# Altium schematic sheet revision_log.schdoc: Revision Log
size 431 x 279 mm; DrawnBy: D. Bruey, M. Ciuffo; Organization: Synapse Product Development, LLC.; Address1: 1511 6th Ave., Suite 400; Address2: Seattle, Washington 98101; Address3: 206.381.0898; Address4: www.synapse.com; DocumentNumber: 2; SheetNumber: 2; SheetTotal: 2; PageSetup: Record=PageOptions|CenterHorizontal=True|CenterVertical=True|PrintScale=1.06|XCorrection=1.00|YCorrection=1.00|PrintKind=1|BorderSize=5000000|LeftOffset=0|BottomOffset=0|Orientation=2|PaperLength=4318|PaperWidth=2794|Scale=100|PaperSource=7|PrintQuality=200|MediaType=1|DitherType=10|PrintScaleMode=1|PaperKind=11x17|PaperIndex=3
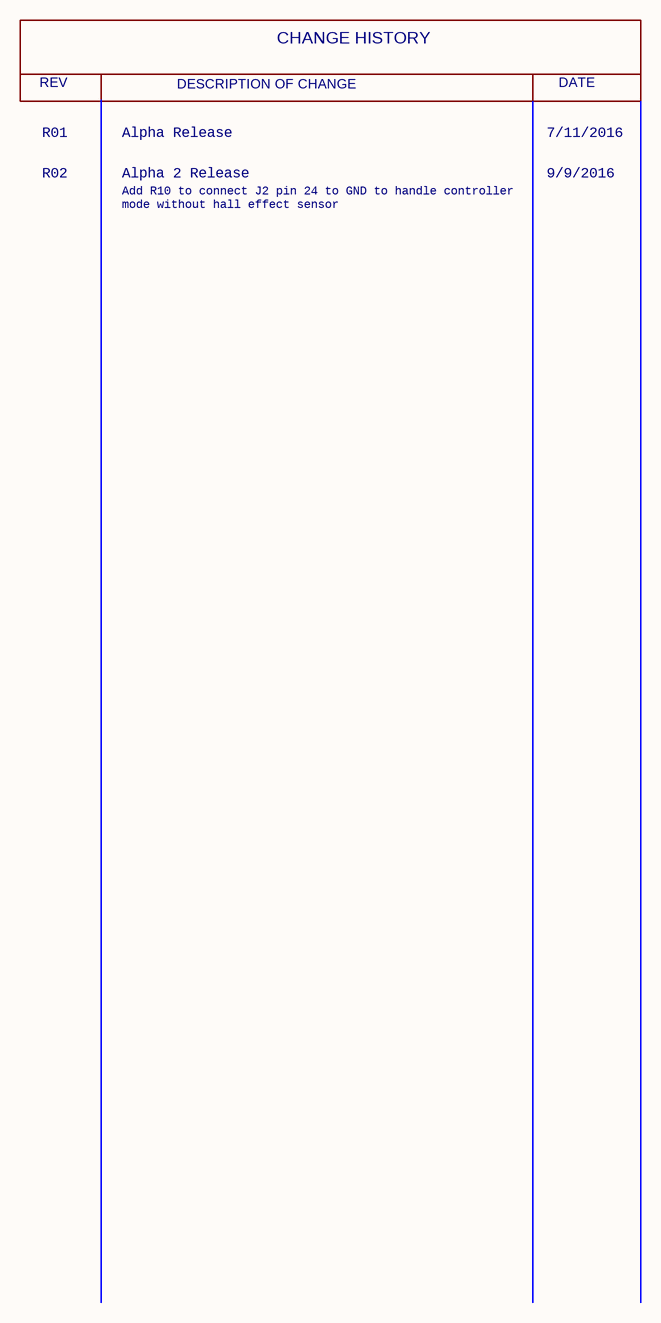
[diagram p0: revision_log.schdoc]

## Notes on the sheet
- REV
- DESCRIPTION OF CHANGE
- CHANGE HISTORY
- DATE
- R01
- Alpha Release
- 7/11/2016
- R02
- Alpha 2 Release
- 9/9/2016
- Add R10 to connect J2 pin 24 to GND to handle controller mode without hall effect sensor
- Design Notes:
- Layout Notes:
- Project:
- Sheet Title:
- PCBA:
- PROPRIETARY AND CONFIDENTIAL
- Drawn by:
- Schematic Part Number:
- Schematic Revision:
- Date:
- Sheet:
- /